# Altium schematic sheet Main.SchDoc
size A4; SheetNumber: 2; SheetTotal: 3
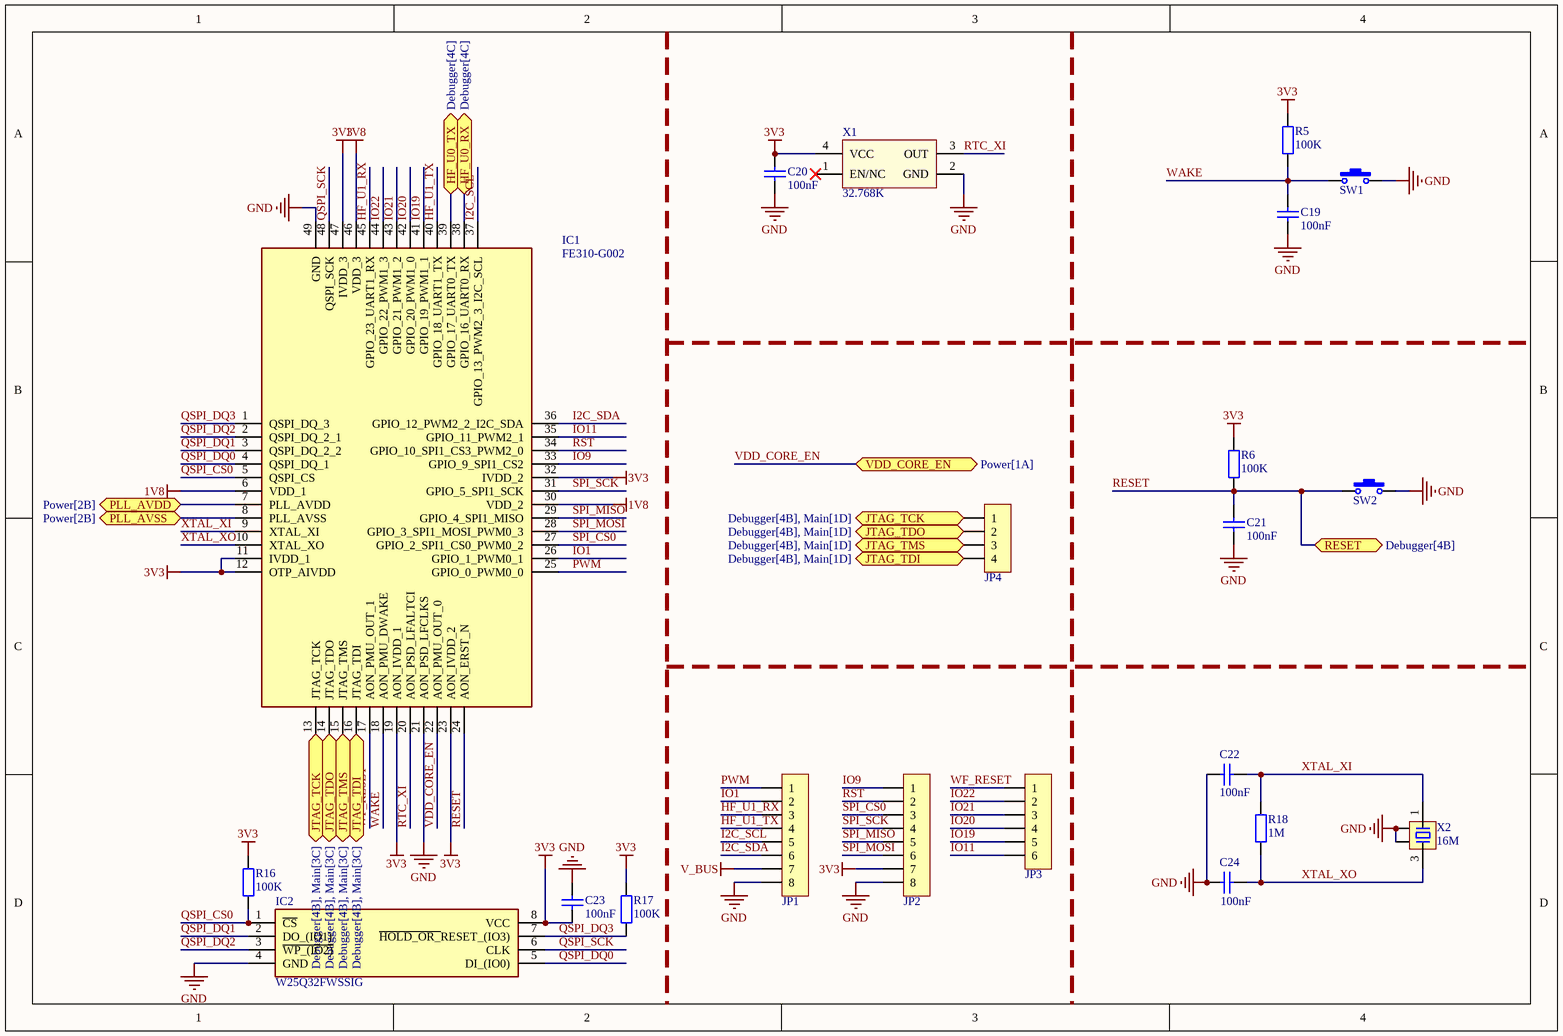
[diagram p0: Main.SchDoc]

## Parts
C19  100nF  [C0603_NS]
C20  100nF  [C0603_NS]
C21  100nF  [C0603_NS]
C22  100nF  [C0603_NS]
C23  100nF  [C0603_NS]
C24  100nF  [C0603_NS]
IC1  FE310-G002  [QFN40P600X600X93-49N]
IC2  W25Q32FWSSIG  [SOIC127P790X216-8N]
JP1  HDR-1X8  [HDR2.54-M-LI-8P]  (value not drawn)
JP2  HDR-1X8  [HDR2.54-M-LI-8P]  (value not drawn)
JP3  HDR-1X6  [HDR2.54-LI-6P]  (value not drawn)
JP4  HDR-1X4  [HDR2.54-LI-4P]  (value not drawn)
R5  100K  [R0603_NS]
R6  100K  [R0603_NS]
R16  100K  [R0603_NS]
R17  100K  [R0603_NS]
R18  1M  [R0603_NS]
SW1  3x6x5  [SW SMD-3*6*2.5]  (value not drawn)
SW2  3x6x5  [SW SMD-3*6*2.5]  (value not drawn)
X1  32.768K  [OSC-3225-4P]
X2  16M  [XTAL-3225-4P]

## Ports
HF_U0_RX (bidir, see Debugger[4C]), HF_U0_TX (bidir, see Debugger[4C]), JTAG_TCK (bidir, see Debugger[4B], Main[1D]), JTAG_TCK (bidir, see Debugger[4B], Main[3C]), JTAG_TDI (bidir, see Debugger[4B], Main[1D]), JTAG_TDI (bidir, see Debugger[4B], Main[3C]), JTAG_TDO (bidir, see Debugger[4B], Main[1D]), JTAG_TDO (bidir, see Debugger[4B], Main[3C]), JTAG_TMS (bidir, see Debugger[4B], Main[1D]), JTAG_TMS (bidir, see Debugger[4B], Main[3C]), PLL_AVDD (bidir, see Power[2B]), PLL_AVSS (bidir, see Power[2B]), RESET (bidir, see Debugger[4B]), VDD_CORE_EN (bidir, see Power[1A])

## Nets
1V8: IC1.6(VDD_1) IC1.30(VDD_2) IC1.46(VDD_3)
3V3: C20.2 C23.1 IC1.11(IVDD_1) IC1.12(OTP_AIVDD) IC1.19(AON_IVDD_1) IC1.23(AON_IVDD_2) IC1.32(IVDD_2) IC1.47(IVDD_3) IC2.8(VCC) JP2.7 R5.2 R6.2 R16.2 R17.2 X1.4(VCC)
GND: C19.1 C20.1 C21.1 C22.1 C23.2 C24.2 IC1.21(AON_PSD_LFCLKS) IC1.49(GND) IC2.4(GND) JP1.8 JP2.8 SW1.2 SW2.2 X1.2(GND) X2.2 X2.4
V_BUS: JP1.7
HF_U0_RX: IC1.38(GPIO_16_UART0_RX) ; port HF_U0_RX
HF_U0_TX: IC1.39(GPIO_17_UART0_TX) ; port HF_U0_TX
HF_U1_RX: IC1.45(GPIO_23_UART1_RX) JP1.3
HF_U1_TX: IC1.40(GPIO_18_UART1_TX) JP1.4
I2C_SCL: IC1.37(GPIO_13_PWM2_3_I2C_SCL) JP1.5
I2C_SDA: IC1.36(GPIO_12_PWM2_2_I2C_SDA) JP1.6
IO1: IC1.26(GPIO_1_PWM0_1) JP1.2
IO9: IC1.33(GPIO_9_SPI1_CS2) JP2.1
IO11: IC1.35(GPIO_11_PWM2_1) JP3.6
IO19: IC1.41(GPIO_19_PWM1_1) JP3.5
IO20: IC1.42(GPIO_20_PWM1_0) JP3.4
IO21: IC1.43(GPIO_21_PWM1_2) JP3.3
IO22: IC1.44(GPIO_22_PWM1_3) JP3.2
JTAG_TCK: IC1.13(JTAG_TCK) JP4.1 ; port JTAG_TCK
JTAG_TDI: IC1.16(JTAG_TDI) JP4.4 ; port JTAG_TDI
JTAG_TDO: IC1.14(JTAG_TDO) JP4.2 ; port JTAG_TDO
JTAG_TMS: IC1.15(JTAG_TMS) JP4.3 ; port JTAG_TMS
PLL_AVDD: IC1.7(PLL_AVDD) ; port PLL_AVDD
PLL_AVSS: IC1.8(PLL_AVSS) ; port PLL_AVSS
PWM: IC1.25(GPIO_0_PWM0_0) JP1.1
QSPI_CS0: IC1.5(QSPI_CS) IC2.1(~{CS}) R16.1
QSPI_DQ0: IC1.4(QSPI_DQ_1) IC2.5(DI_(IO0))
QSPI_DQ1: IC1.3(QSPI_DQ_2_2) IC2.2(DO_(IO1))
QSPI_DQ2: IC1.2(QSPI_DQ_2_1) IC2.3(~{WP_(IO2)})
QSPI_DQ3: IC1.1(QSPI_DQ_3) IC2.7(~{HOLD_OR_}RESET_(IO3)) R17.1
QSPI_SCK: IC1.48(QSPI_SCK) IC2.6(CLK)
RESET: C21.2 IC1.24(AON_ERST_N) R6.1 SW2.1 ; port RESET
RST: IC1.34(GPIO_10_SPI1_CS3_PWM2_0) JP2.2
RTC_XI: IC1.20(AON_PSD_LFALTCI) X1.3(OUT)
SPI_CS0: IC1.27(GPIO_2_SPI1_CS0_PWM0_2) JP2.3
SPI_MISO: IC1.29(GPIO_4_SPI1_MISO) JP2.5
SPI_MOSI: IC1.28(GPIO_3_SPI1_MOSI_PWM0_3) JP2.6
SPI_SCK: IC1.31(GPIO_5_SPI1_SCK) JP2.4
VDD_CORE_EN: IC1.22(AON_PMU_OUT_0) ; port VDD_CORE_EN
WAKE: C19.2 IC1.18(AON_PMU_DWAKE) R5.1 SW1.1
WF_RESET: IC1.17(AON_PMU_OUT_1) JP3.1
XTAL_XI: C22.2 IC1.9(XTAL_XI) R18.2 X2.1
XTAL_XO: C24.1 IC1.10(XTAL_XO) R18.1 X2.3

Not connected (* = marked no-connect by the designer): X1 1(EN/NC)*

## Library data of the parts
C19-C24 = C: 贴片电容/MLCC电容; BOM名称: 无极性贴片电容; 联系卖家，免费查找封装: 唯一出售店铺网址https://shop463601444.taobao.com
IC1 = FE310-G002: Integrated Circuit; Manufacturer_Name: SiFive; Datasheet Link: https://sifive.cdn.prismic.io/sifive%2F3d777659-a0dd-49ed-a011-5bebba17aecf_fe310-g002-ds.pdf; Height: 0.93mm; Manufacturer_Part_Number: FE310-G002
IC2 = W25Q32FWSSIG: Integrated Circuit; Manufacturer_Name: Winbond; Datasheet Link: http://www.winbond.com/resource-files/w25q32fw%20revj%2004242018%20sfdp.pdf; Height: 2.16mm; Manufacturer_Part_Number: W25Q32FWSSIG; Mouser Part Number: 454-W25Q32FWSSIG; Mouser Price/Stock: https://www.mouser.com/Search/Refine.aspx?Keyword=454-W25Q32FWSSIG; Arrow Part Number: W25Q32FWSSIG; Arrow Price/Stock: https://www.arrow.com/en/products/w25q32fwssig/winbond-electronics
JP1 JP2 = Header 8: 8P接插件; 联系卖家，免费查找封装: 唯一出售店铺网址https://shop463601444.taobao.com; 封装库来自淘宝卖家ID:黄晶宝石: 其他店铺购入均为盗版假冒封装库，请立即申请退款，本店现金奖励20~200元; BOM名称: 8P接插件
JP3 = Header 6: 6P接插件; 联系卖家，免费查找封装: 唯一出售店铺网址https://shop463601444.taobao.com; 封装库来自淘宝卖家ID:黄晶宝石: 其他店铺购入均为盗版假冒封装库，请立即申请退款，本店现金奖励20~200元; BOM名称: 6P接插件
JP4 = Header 4: 4P接插件; 联系卖家，免费查找封装: 唯一出售店铺网址https://shop463601444.taobao.com; 封装库来自淘宝卖家ID:黄晶宝石: 其他店铺购入均为盗版假冒封装库，请立即申请退款，本店现金奖励20~200元; BOM名称: 4P接插件
R5 R6 R16-R18 = R: 贴片电阻; 联系卖家，免费查找封装: 唯一出售店铺网址https://shop463601444.taobao.com; BOM名称: 贴片电阻
SW1 SW2 = SW 3x6: 3x6轻触开关; 联系卖家，免费查找封装: 唯一出售店铺网址https://shop463601444.taobao.com; 封装库来自淘宝卖家ID：黄晶宝石: 其他店铺购入的，请立即申请退款，本店现金奖励20~500元; BOM名称: 3x6轻触开关
X1 = XTAL-ACT-4P: 4脚有源晶振(振荡器); 联系卖家，免费查找封装: 唯一出售店铺网址https://shop463601444.taobao.com; BOM名称: 有源晶振(振荡器)
X2 = XTAL-4P: 4脚无源晶振(谐振器）; 联系卖家，免费查找封装: 唯一出售店铺网址https://shop463601444.taobao.com; BOM名称: 4脚无源晶振(谐振器）